# EAGLE design weichen-a-6 (EAGLE 9.6.2)
AUTHOR: Balazs Racz; DRAWING_TITLE: MEB Schalterwerk Projekt; LICENSE: Licensed by the Solderpad Hardware License V2.0; REVIEWER: n/a; REVISION: A5; YEAR: 2023
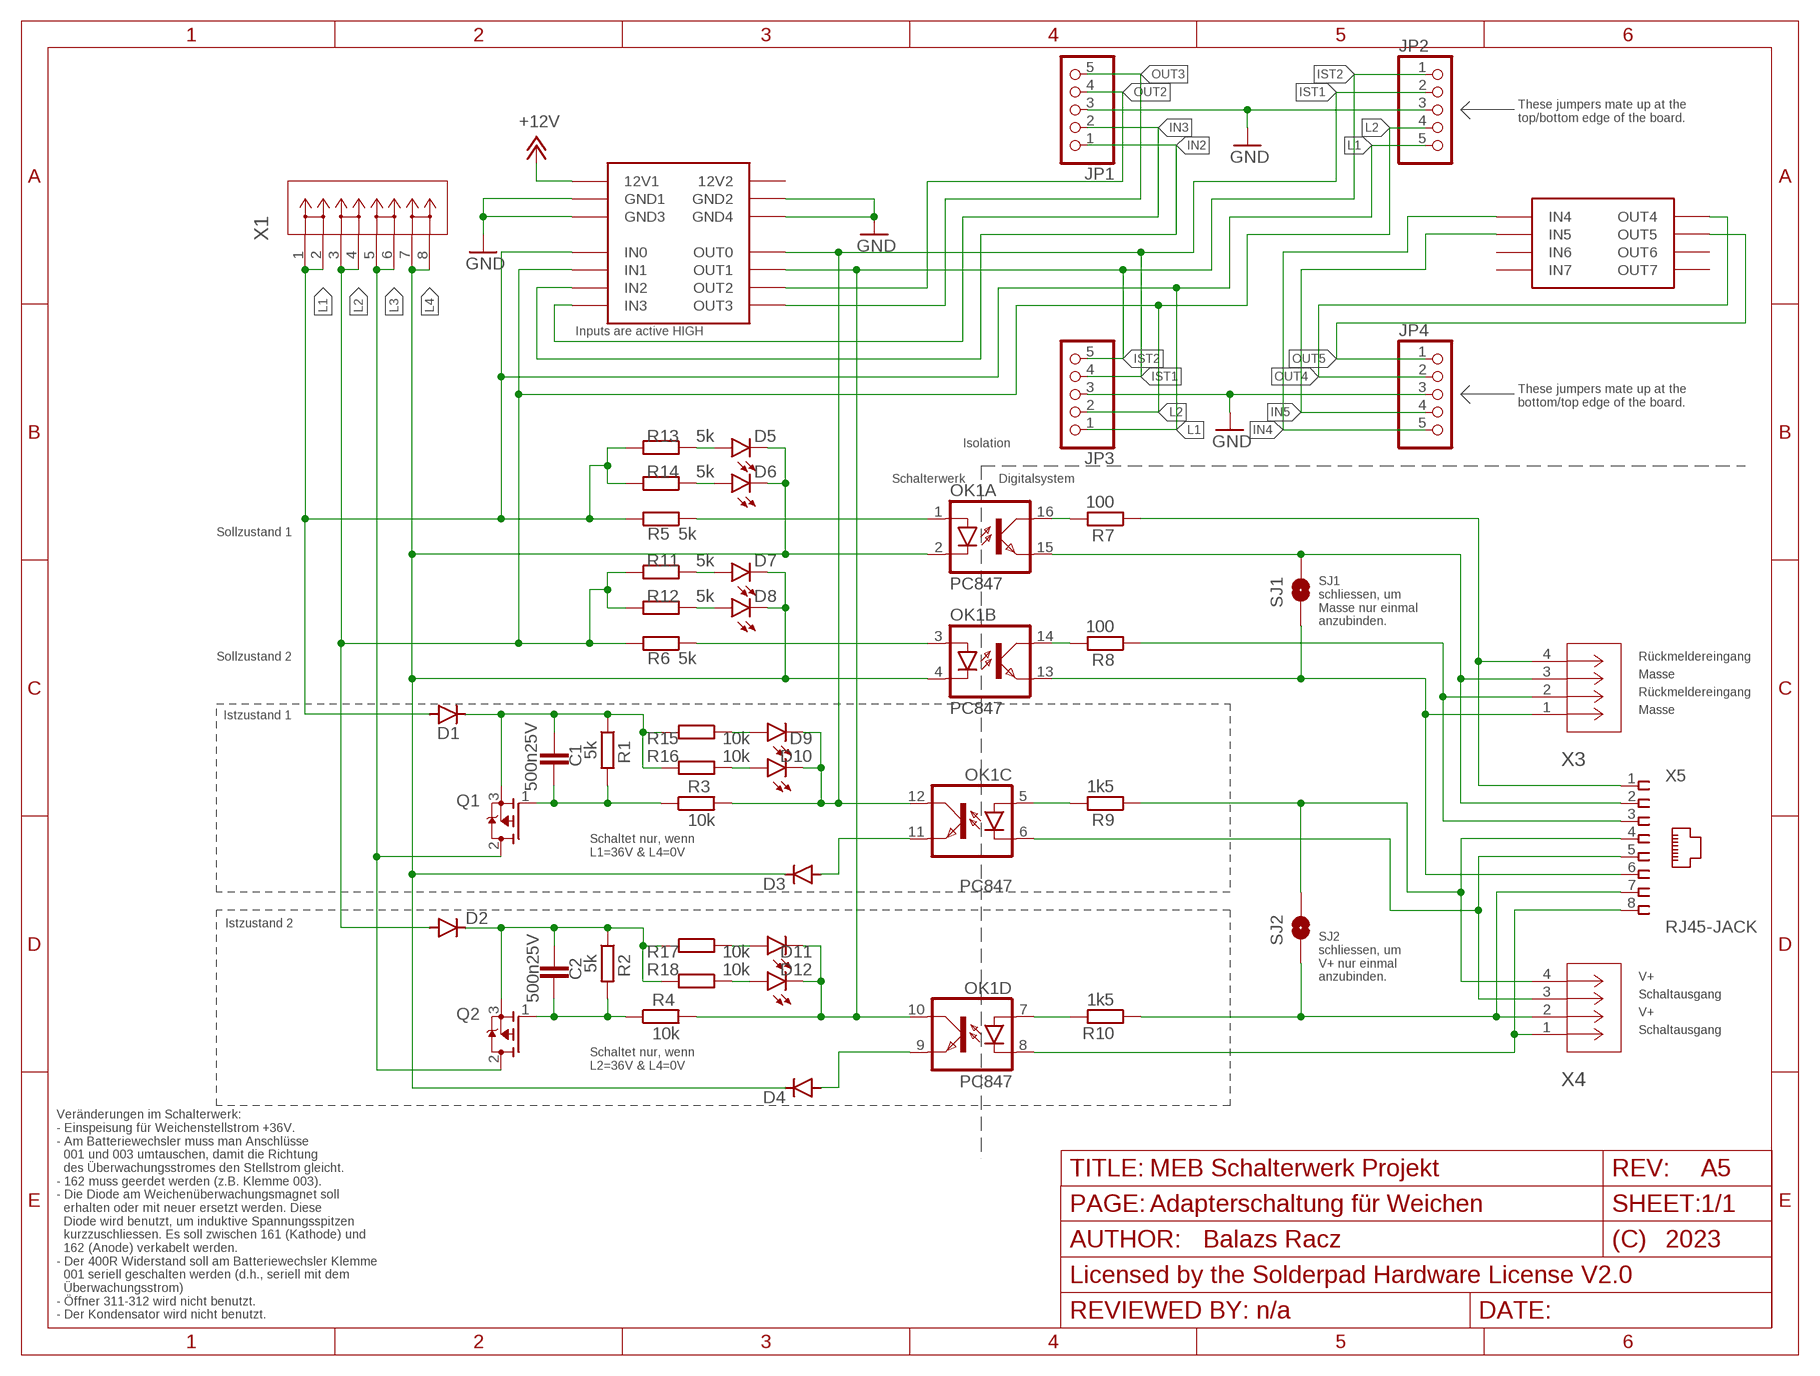
[diagram p0: schematic, sheet 1]
FRAME1 (FRAME_A_L): PAGE: Input ports
FRAME2 (FRAME_A_L): PAGE: Adapterschaltung für Weichen

## Parts
C1  500n25V  C-EUC0805  [C0805]
C2  500n25V  C-EUC0805  [C0805]
D1  DIODE-DO214AC  [DO214AC]
D2  DIODE-DO214AC  [DO214AC]
D3  DIODE-MINIMELF  [MINIMELF]
D4  DIODE-MINIMELF  [MINIMELF]
D5  LEDCHIPLED_0603  [CHIPLED_0603]
D6  LEDHEADER  [LEDHEADER]
D7  LEDCHIPLED_0603  [CHIPLED_0603]
D8  LEDHEADER  [LEDHEADER]
D9  LEDCHIPLED_0603  [CHIPLED_0603]
D10  LEDHEADER  [LEDHEADER]
D11  LEDCHIPLED_0603  [CHIPLED_0603]
D12  LEDHEADER  [LEDHEADER]
JP1  PINHD-1X5-EDGE  [1X05]
JP2  PINHD-1X5-EDGE  [1X05]
JP3  PINHD-1X5-EDGE  [1X05]
JP4  PINHD-1X5-EDGE  [1X05]
OK1  PC847  [DIL16]
Q1  P-MOSFET  [DPAK-2]
Q2  P-MOSFET  [DPAK-2]
R1  5k  R-EU_R0805  [R0805]
R2  5k  R-EU_R0805  [R0805]
R3  10k  R-EU_R0805  [R0805]
R4  10k  R-EU_R0805  [R0805]
R5  5k  R-EU_R0805  [R0805]
R6  5k  R-EU_R0805  [R0805]
R7  100  R-EU_R0805  [R0805]
R8  100  R-EU_R0805  [R0805]
R9  1k5  R-EU_R0805  [R0805]
R10  1k5  R-EU_R0805  [R0805]
R11  5k  R-EU_R0805  [R0805]
R12  5k  R-EU_R0805  [R0805]
R13  5k  R-EU_R0805  [R0805]
R14  5k  R-EU_R0805  [R0805]
R15  10k  R-EU_R0805  [R0805]
R16  10k  R-EU_R0805  [R0805]
R17  10k  R-EU_R0805  [R0805]
R18  10k  R-EU_R0805  [R0805]
SJ1  SJRND2  [SJ_RND2]
SJ2  SJRND2  [SJ_RND2]
X1  PHNX_4P_508CONN_1017493  [PHNX_4P_508]
X2  IO-HAT  [IOBOARD]
X3  PHNX_4P_350CONN_1984989_PXC  [PHNX_4P_350]
X4  PHNX_4P_350CONN_1984989_PXC  [PHNX_4P_350]
X5  RJ45-JACK  RJ45-JACKRJ45-PULSE-E5J00  [RJ45-PULSE-E5J88]

## Nets
+12V: X2.P$1(12V1)
GND: JP1.3 JP2.3 JP3.3 JP4.3 X2.P$2(GND1) X2.P$11(GND3) X2.P$12(GND4) X2.P$21(GND2)
IN2: JP1.1 X2.P$5(IN2)
IN3: JP1.2 X2.P$6(IN3)
IN4: JP4.5 X2.P$7(IN4)
IN5: JP4.4 X2.P$8(IN5)
IST1: D9.C D10.C JP2.2 JP3.4 OK1.12(C:COL) R3.2 X2.P$20(OUT0)
IST2: D11.C D12.C JP2.1 JP3.5 OK1.10(D:COL) R4.2 X2.P$19(OUT1)
L1: D1.A JP2.5 JP3.1 R5.2 R13.2 R14.2 X1.1 X1.2 X2.P$3(IN0)
L2: D2.A JP2.4 JP3.2 R6.2 R11.2 R12.2 X1.3 X1.4 X2.P$4(IN1)
L3: Q1.2(D) Q2.2(D) X1.5 X1.6
L4: D3.C D4.C D5.C D6.C D7.C D8.C OK1.2(A:C) OK1.4(B:C) X1.7 X1.8
N$1: C2.1 D2.C Q2.3(S) R2.1 R17.2 R18.2
N$2: OK1.1(A:A) R5.1
N$3: D7.A R11.1
N$4: D5.A R13.1
N$5: OK1.5(C:A) R9.2
N$6: D6.A R14.1
N$7: OK1.3(B:A) R6.1
N$8: OK1.7(D:A) R10.2
N$10: D8.A R12.1
N$11: D9.A R15.1
N$12: C2.2 Q2.1(G) R2.2 R4.1
N$13: C1.1 D1.C Q1.3(S) R1.1 R15.2 R16.2
N$14: D10.A R16.1
N$17: D3.A OK1.11(C:EMIT)
N$18: D11.A R17.1
N$19: OK1.16(A:COL) R7.2
N$20: D12.A R18.1
N$21: OK1.14(B:COL) R8.2
N$22: D4.A OK1.9(D:EMIT)
N$23: C1.2 Q1.1(G) R1.2 R3.1
NX41: R7.1 X3.4 X5.1
NX42: OK1.15(A:EMIT) SJ1.P$2 X3.3 X5.2
NX43: R8.1 X3.2 X5.3
NX44: R9.1 SJ2.P$2 X4.4 X5.4
NX45: OK1.6(C:C) X4.3 X5.5
NX46: OK1.13(B:EMIT) SJ1.P$1 X3.1 X5.6
NX47: R10.1 SJ2.P$1 X4.2 X5.7
NX48: OK1.8(D:C) X4.1 X5.8
OUT2: JP1.4 X2.P$18(OUT2)
OUT3: JP1.5 X2.P$17(OUT3)
OUT4: JP4.2 X2.P$16(OUT4)
OUT5: JP4.1 X2.P$15(OUT5)
Unconnected: X2.P$9(IN6) X2.P$10(IN7) X2.P$13(OUT7) X2.P$14(OUT6)

## Notes on the sheet
- These jumpers mate up at the 
  top/bottom edge of the board.
- Inputs are active HIGH
- These jumpers mate up at the 
  bottom/top edge of the board.
- Isolation
- Schalterwerk | Digitalsystem
- Sollzustand 1
- SJ1
  schliessen, um
  Masse nur einmal
  anzubinden.
- Sollzustand 2 | Rückmeldereingang
- Masse
- Rückmeldereingang
- Masse
- Istzustand 1
- Schaltet nur, wenn
  L1=36V & L4=0V
- Istzustand 2
- SJ2
  schliessen, um
  V+ nur einmal
  anzubinden.
- V+
- Schaltausgang
- V+
- Schaltausgang
- Schaltet nur, wenn
  L2=36V & L4=0V
- Veränderungen im Schalterwerk:
  - Einspeisung für Weichenstellstrom +36V.
  - Am Batteriewechsler muss man Anschlüsse
    001 und 003 umtauschen, damit die Richtung
    des Überwachungsstromes den Stellstrom gleicht.
  - 162 muss geerdet werden (z.B. Klemme 003).
  - Die Diode am Weichenüberwachungsmagnet soll 
    erhalten oder mit neuer ersetzt werden. Diese
    Diode wird benutzt, um induktive Spannungsspitzen
    kurzzuschliessen. Es soll zwischen 161 (Kathode) und
    162 (Anode) verkabelt werden.
  - Der 400R Widerstand soll am Batteriewechsler Klemme
    001 seriell geschalten werden (d.h., seriell mit dem 
    Überwachungsstrom)
  - Öffner 311-312 wird nicht benutzt.
  - Der Kondensator wird nicht benutzt.

## Power pins joined to a net without a drawn wire
12V2: X2.P$22(12V2)

## Library data of the parts
C1 C2 = rcl:C-EU: CAPACITOR, European symbol; SPICEPREFIX: C
D1-D4 = diode:DIODE-: DIODE
D5 D7 D9 D11 = led:LED: LED OSRAM: - CHIPLED LG R971, LG N971, LY N971, LG Q971, LY Q971, LO R971, LY R971 LH N974, LH R974 LS Q976, LO Q976, LY Q976 LO Q996 - Hyper CHIPLED LW Q18S LB Q993, LB Q99A, LB R99A - SideLED LS A670, LO A670, LY A670, LG A670, LP A670 LB A673, LV A673, LT A673, LW A673 LH A674 LY A675 LS A676, LA A676, LO A676, LY A676, LW A676 LS A679, LY A679, LG A679 - Hyper Micro SIDELED® LS Y876, LA Y876, LO Y876, LY Y876 LT Y87S - SmartLED LW L88C, LW L88S LB L89C, LB L89S, LG L890 LS L89K, LO L89K, LY L89K LS L896, LA L896, LO L896, LY L896 - TOPLED LS T670, LO T670, LY T670, LG T670, LP T670 LSG T670, LSP T670, LSY T670, LOP T670, LYG T670 LG T671, LOG T671, LSG T671 LB T673, LV T673, LT T673, LW T673 LH T674 LS T676, LA T676, LO T676, LY T676, LB T676, LH T676, LSB T676, LW T676 LB T67C, LV T67C, LT T67C, LS T67K, LO T67K, LY T67K, LW E67C LS E67B, LA E67B, LO E67B, LY E67B, LB E67C, LV E67C, LT E67C LW T67C LS T679, LY T679, LG T679 LS T770, LO T770, LY T770, LG T770, LP T770 LB T773, LV T773, LT T773, LW T773 LH T774 LS E675, LA E675, LY E675, LS T675 LS T776, LA T776, LO T776, LY T776, LB T776 LHGB T686 LT T68C, LB T68C - Hyper Mini TOPLED® LB M676 - Mini TOPLED Santana® LG M470 LS M47K, LO M47K, LY M47K Source: http://www.osram.convergy.de LUXEON: - LUMILED® LXK2-PW12-R00, LXK2-PW12-S00, LXK2-PW14-U00, LXK2-PW14-V00 LXK2-PM12-R00, LXK2-PM12-S00, LXK2-PM14-U00 LXK2-PE12-Q00, LXK2-PE12-R00, LXK2-PE12-S00, LXK2-PE14-T00, LXK2-PE14-U00 LXK2-PB12-K00, LXK2-PB12-L00, LXK2-PB12-M00, LXK2-PB14-N00, LXK2-PB14-P00, LXK2-PB14-Q00 LXK2-PR12-L00, LXK2-PR12-M00, LXK2-PR14-Q00, LXK2-PR14-R00 LXK2-PD12-Q00, LXK2-PD12-R00, LXK2-PD12-S00 LXK2-PH12-R00, LXK2-PH12-S00 LXK2-PL12-P00, LXK2-PL12-Q00, LXK2-PL12-R00 Source: www.luxeon.com KINGBRIGHT: KA-3528ASYC Source: www.kingbright.com
D6 D8 D10 D12 = eagleparts:LEDHEADER
JP1-JP4 = eagleparts:PINHD-1X5-EDGE: PIN HEADER
OK1 = optocoupler:PC847: SHARP OPTO COUPLER; OC_FARNELL: 9707735; OC_NEWARK: unknown
Q1 Q2 = eagleparts:P-MOSFET: RoHS Compliant | Low RDS(on) | Industry-leading quality | Dynamic dv/dt Rating | Fast Switching | Fully Avalanche Rated | 175C Operating Temperature | P-Channel MOSFET; MANUFACTURER: Infineon; MAXIMUM_PACKAGE_HEIGHT: 2.39 mm; PARTREV: 12/14/04; STANDARD: IPC-7351B
R1-R18 = rcl:R-EU_: RESISTOR, European symbol; SPICEPREFIX: R
SJ1 SJ2 = eagleparts:SJ: SMD solder JUMPER
X1 = eagleparts:PHNX_4P_508: https://www.digikey.com/en/products/detail/phoenix-contact/1017505/9346606 DigiKey 277-17516-ND; COPYRIGHT: Copyright (C) 2023 Ultra Librarian. All rights reserved.; MANUFACTURER_PART_NUMBER: 1017505; MFR_NAME: Phoenix Contact
X2 = eagleparts:IO-HAT
X3 X4 = eagleparts:PHNX_4P_350: https://www.digikey.com/en/products/detail/phoenix-contact/1984989/2513979 DigiKey 277-6404-ND; COPYRIGHT: Copyright (C) 2023 Ultra Librarian. All rights reserved.; MANUFACTURER_PART_NUMBER: 1984989; MFR_NAME: Phoenix Contact
X5 = trainlib:RJ45-JACK: Mod. Jack, Right Angle, 8 posiotion, 8 contatcs RJ45 Source: GLX-S-88M.pdf

## Board
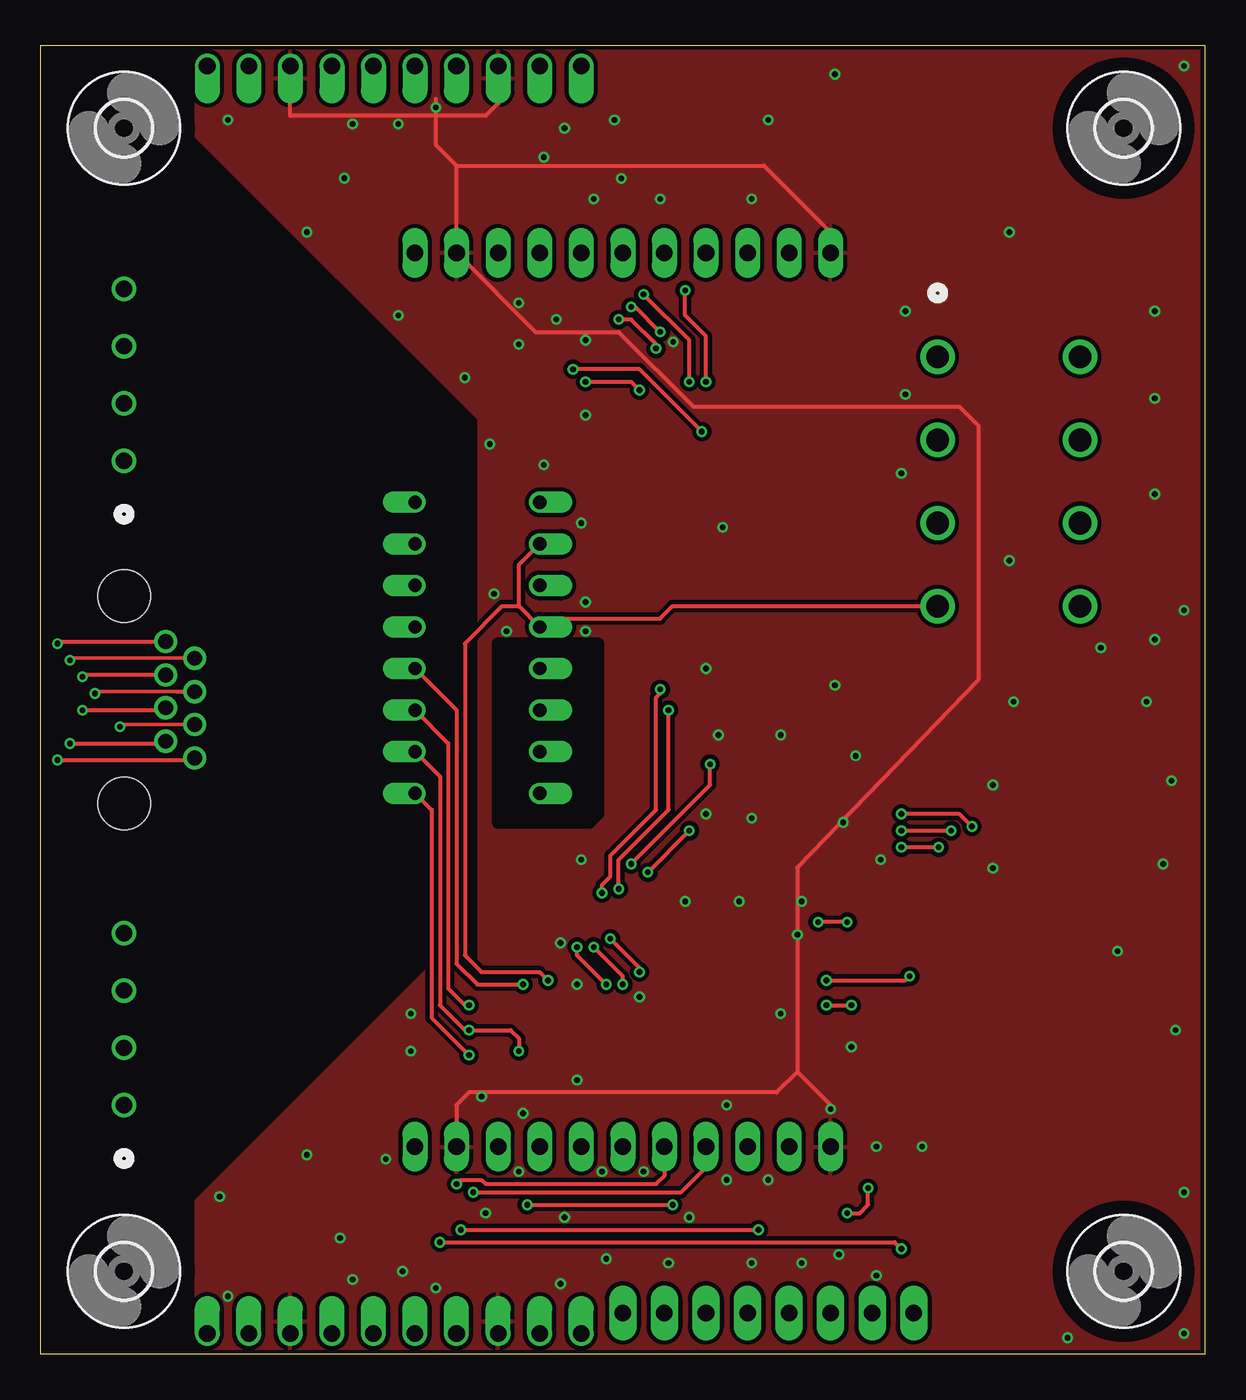
[diagram p1: board, top side]
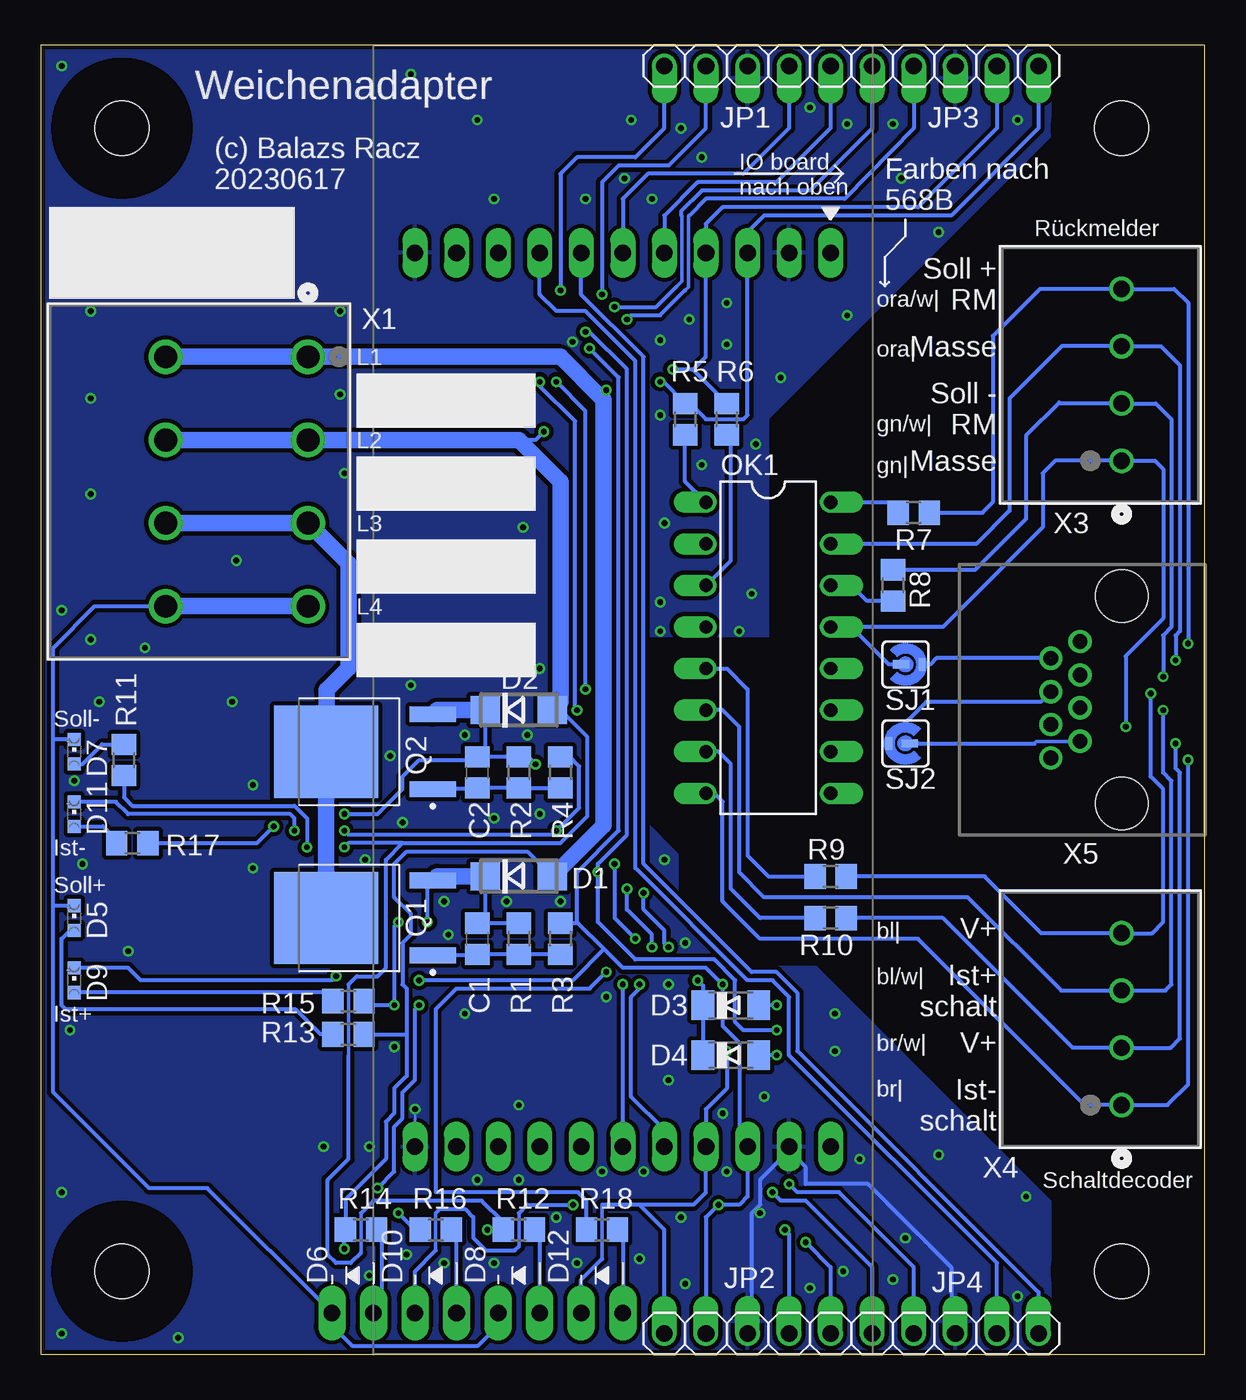
[diagram p2: board, bottom side, seen from below]

Size 71.12 x 80 mm. Coordinates in mm from the lower left corner, seen from the top.
Outline: 71.12,0 0,0 0,80 71.12,80 71.12,0
Copper layers (1*16): Top 0.035mm / dielectric 1.5mm / Bottom 0.035mm
Design rules "SeeedStudio_2layer_DRU_no_angle_20140221": minimum track width 6mil, minimum drill 12mil, track to track 6mil, track to pad 6mil, pad to pad 6mil, via to via 6mil, smd to smd 0mil, copper to edge 10mil, drill to drill 10mil, minimum pad ring 10mil, minimum via ring 6mil, stop-mask expansion 2mil, vias tented up to drill 100mil, thermal gap 10mil
tRestrict: area 27.9,32.5 to 34,43.4
bRestrict: area 19.1,24.1 to 34,43.4

### Footprints (pad centres in the part's own frame; a part is rotated, then mirrored left to right if it is on the bottom)
C0805 = smd 1.3 x 1.5: 1 -0.95,0; 2 0.95,0
DO214AC = smd 1.8 x 1.7: A 2.05,0; C -2.05,0
MINIMELF = smd 1.4 x 1.8: A 1.7,0; C -1.7,0
CHIPLED_0603 = smd 0.8 x 0.8: A 0,-0.75; C 0,0.75
LEDHEADER = drill 1.016 pad 1.676 long: A -1.27,0; C 1.27,0
3,3 = hole 3.3: 0,0
1X05 = drill 1.016 offset: 1 -5.08,0; 2 -2.54,0; 3 0,0; 4 2.54,0; 5 5.08,0
DIL16 = drill 0.813 offset: 1 -8.89,-3.81; 2 -6.35,-3.81; 3 -3.81,-3.81; 4 -1.27,-3.81; 5 1.27,-3.81; 6 3.81,-3.81; 7 6.35,-3.81; 8 8.89,-3.81; 9 8.89,3.81; 10 6.35,3.81; 11 3.81,3.81; 12 1.27,3.81; 13 -1.27,3.81; 14 -3.81,3.81; 15 -6.35,3.81; 16 -8.89,3.81
DPAK-2 = smd 2.83 x 0.97: 1 -4.14,2.29; 3 -4.14,-2.29 | smd 6.35 x 5.63: 2 2.38,0
R0805 = smd 1.3 x 1.5: 1 -0.95,0; 2 0.95,0
SJ_RND2 = smd 1.016 x 0.508: P$1 -0.254,0 | smd 0.406 x 0.813: P$2 1.016,0
PHNX_4P_508 = drill 1.397 pad 1.905: 1 -15.24,8.7; 2 -15.24,0; 3 -10.16,8.7; 4 -10.16,0; 5 -5.08,8.7; 6 -5.08,0; 7 0,8.7; 8 0,0
IOBOARD = drill 1.016 pad 1.524 long: P$1 12.7,27.94; P$2 12.7,25.4; P$3 12.7,22.86; P$4 12.7,20.32; P$5 12.7,17.78; P$6 12.7,15.24; P$7 12.7,12.7; P$8 12.7,10.16; P$9 12.7,7.62; P$10 12.7,5.08; P$11 12.7,2.54; P$12 67.31,2.54; P$13 67.31,5.08; P$14 67.31,7.62; P$15 67.31,10.16; P$16 67.31,12.7; P$17 67.31,15.24; P$18 67.31,17.78; P$19 67.31,20.32; P$20 67.31,22.86; P$21 67.31,25.4; P$22 67.31,27.94
PHNX_4P_350 = drill 0.991 pad 1.499: 1 0,0; 2 3.5,0; 3 7,0; 4 10.5,0
RJ45-PULSE-E5J88 = drill 0.9 pad 1.422: 1 3.555,2.54; 2 2.535,4.32; 3 1.515,2.54; 4 0.495,4.32; 5 -0.495,2.54; 6 -1.515,4.32; 7 -2.535,2.54; 8 -3.555,4.32 | hole 3.2: 6.35,0; -6.35,0

### Placement (x,y rotation side)
C1  44.45,25.4 270 bottom
C2  44.45,35.56 270 bottom
D1  41.91,29.21 0 bottom
D2  41.91,39.37 0 bottom
D3  28.96,21.34 0 bottom
D4  28.96,18.29 0 bottom
D5  69.09,26.67 0 bottom
D6  52.07,2.54 180 bottom
D7  69.09,36.83 0 bottom
D8  41.91,2.54 180 bottom
D9  69.09,22.86 0 bottom
D10  46.99,2.54 180 bottom
D11  69.09,33.02 0 bottom
D12  36.83,2.54 180 bottom
H1  MOUNT-HOLE3.3  [3,3]  66.17,74.93 0 top
H2  MOUNT-HOLE3.3  [3,3]  66.17,5.08 0 top
H3  MOUNT-HOLE3.3  [3,3]  5.08,5.08 0 top
H4  MOUNT-HOLE3.3  [3,3]  5.08,74.93 0 top
JP1  27.94,78.74 180 bottom
JP2  27.94,1.27 0 bottom
JP3  15.24,78.74 180 bottom
JP4  15.24,1.27 0 bottom
OK1  26.67,43.18 270 bottom
Q1  51.31,26.67 180 bottom
Q2  51.31,36.83 180 bottom
R1  41.91,25.4 270 bottom
R2  41.91,35.56 270 bottom
R3  39.37,25.4 90 bottom
R4  39.37,35.56 90 bottom
R5  31.75,57.15 90 bottom
R6  29.21,57.15 90 bottom
R7  17.78,51.44 180 bottom
R8  19.05,46.99 270 bottom
R9  22.86,29.21 180 bottom
R10  22.86,26.67 180 bottom
R11  66.04,36.32 270 bottom
R12  41.91,7.62 180 bottom
R13  52.32,19.56 0 bottom
R14  51.56,7.62 180 bottom
R15  52.32,21.59 0 bottom
R16  46.99,7.62 180 bottom
R17  65.53,31.24 0 bottom
R18  36.83,7.62 180 bottom
SJ1  18.29,42.16 0 bottom
SJ2  18.29,37.34 180 bottom
X1  63.5,45.72 270 bottom
X2  50.8,80.01 270 bottom
X3  5.08,54.61 90 bottom
X4  5.08,15.24 90 bottom
X5  5.08,40.01 90 bottom

### Tracks (layer width: path | path; a pad name or v marks a point on that pad's centre or on a via)
GND  (via drill 0.35)
  Top 0.254: JP1.3 27.94,76.45 27.18,75.69 15.24,75.69 JP3.3 | 24.13,76.71 24.13,73.91 25.4,72.64 | 25.4,72.64 X2.P$2 30.23,62.48 35.31,62.48 39.88,57.91 56.13,57.91 57.28,56.77 57.28,41.2 46.23,29.75 46.23,17.27 | 25.4,72.64 44.2,72.64 48.26,68.58 X2.P$11 | v48.26,14.99 48.26,15.24 46.23,17.27 | 46.23,17.27 44.96,16 26.16,16 25.4,15.24 X2.P$21
  Bottom 0.152: X2.P$12 v48.26,14.99
  Bottom 0.254: X2.P$21 25.4,12.45 | 25.4,12.45 27.18,10.67 27.18,9.14 27.69,8.64 27.69,1.52 JP2.3 | JP4.3 15.49,1.52 15.49,5.33 20.57,10.41 24.38,10.41 24.38,11.43 25.4,12.45
  other vias: 45.21,20.83 36.58,21.84 32.77,16.76 32.77,22.61 22.61,20.83 22.61,18.54 31.75,4.32 10.92,9.65 16.26,12.19 41.91,15.24 51.05,12.7 53.85,12.7 69.34,19.81 69.85,9.91 69.85,1.27 62.74,1.02 43.43,5.59 38.35,5.59 34.54,5.84 46.48,5.59 48.77,6.1 22.1,5.08 18.29,7.11 24.13,4.06 11.43,3.56 21.08,11.94 26.92,15.75 31.75,25.15 33.02,30.23 42.67,27.69 39.37,27.69 46.48,27.69 46.23,25.65 49.78,36.58 45.21,37.85 49.02,32.51 43.43,32.77 40.64,33.02 51.31,30.23 65.79,24.64 68.58,29.97 67.56,39.88 68.07,43.69 64.77,43.18 41.4,37.85 40.64,41.91 48.51,40.89 59.18,48.51 41.66,50.55 52.58,53.85 52.83,58.67 68.07,58.42 68.07,52.58 68.07,63.75 52.83,63.75 59.18,68.58 43.43,70.61 44.45,75.44 35.05,75.44 32,74.93 48.51,78.23 69.85,78.74 24.13,76.2 18.54,71.88 11.43,75.44 21.84,63.5 16.26,68.58 30.73,73.15 25.91,59.69 27.43,55.63 27.69,46.48 28.45,44.2 33.02,50.8 33.27,57.4 33.27,45.97 33.27,44.2 30.73,54.36 29.21,64.26 29.21,61.72 31.5,63.25 33.27,61.98 33.78,70.61 37.85,70.61 29.46,14.73 29.21,11.18 19.05,4.57 69.09,35.05 19.05,75.18 21.84,75.18 35.46,71.86 44.45,10.67 41.91,10.67 49.53,18.8 27.18,8.64 39.62,8.38 32,8.38 34.29,11.18 36.83,11.18 38.63,61.87 51.05,4.83 69.85,45.47 58.17,29.72 58.17,34.8 59.44,39.88
  pour Bottom (isolate 0.254): 70.87,79.76 7.37,79.76 7.37,78.74 9.4,76.71 9.4,74.42 26.67,57.15 26.67,23.88 23.88,23.88 9.4,9.4 9.4,3.3 7.87,1.78 7.87,0.25 70.87,0.25
  pour Top (isolate 0.254): 70.87,79.76 7.37,79.76 7.37,78.74 9.4,76.71 9.4,74.42 26.67,57.15 26.67,23.88 23.88,23.88 9.4,9.4 9.4,3.3 7.87,1.78 7.87,0.25 70.87,0.25
IN2
  Bottom 0.254: JP1.1 22.86,74.93 26.16,71.63 30.99,71.63 33.02,69.6 X2.P$5
IN3
  Bottom 0.254: JP1.2 25.4,74.93 28.19,72.14 34.04,72.14 35.56,70.61 X2.P$6
IN4
  Bottom 0.254: X2.P$7 38.1,64.77 34.29,60.96 34.29,29.97 27.69,23.37 26.16,23.37 24.89,22.1 24.89,18.54 10.16,3.81 JP4.5
IN5
  Bottom 0.254: JP4.4 12.7,5.59 25.4,18.29 25.4,21.84 26.42,22.86 27.94,22.86 34.8,29.72 34.8,60.71 37.85,63.75 39.62,63.75 40.64,64.77 X2.P$8
IST1  (via drill 0.35)  (3 unrouted)
  Top 0.254: OK1.12 25.4,39.37 25.4,23.88 26.67,22.61 v29.46,22.61 | v48.01,22.86 52.83,22.86 v53.09,23.11 | v37.59,61.47 37.59,61.72 36.07,63.25 v35.31,63.25 | v29.72,9.14 v38.61,9.14
  Bottom 0.203: 46.99,6.35 46.99,8.64 | 41.91,6.6 41.91,8.64 | 31.5,69.6 31.55,69.55 31.55,65.23 31.75,65.02
  Bottom 0.254: 38.29,26.35 R3.2 | 36.7,24.77 35.56,23.62 30.48,23.62 v29.46,22.61 29.46,20.07 28.45,19.05 28.45,13.21 X2.P$20 27.94,9.65 28.45,9.14 v29.72,9.14 30.48,8.38 JP2.2 | 36.7,24.77 38.29,26.35 | D10.C 48.26,5.08 46.99,6.35 | 46.99,8.64 46.74,8.89 45.21,8.89 44.7,8.38 44.7,7.11 43.94,6.35 42.16,6.35 41.91,6.6 | 41.91,8.64 41.4,9.14 v38.61,9.14 | 36.7,24.77 38.61,22.86 v48.01,22.86 | v53.09,23.11 53.34,22.86 65.02,22.86 65.79,23.62 69.08,23.62 D9.C | 38.29,26.35 38.35,26.42 38.35,29.46 35.81,32 35.81,59.69 v37.59,61.47 | 31.5,69.6 30.48,70.61 22,70.61 17.78,74.93 JP3.4 | v35.31,63.25 35.05,63.5 33.27,63.5 31.75,65.02
IST2  (via drill 0.35)  (1 unrouted)
  Top 0.254: OK1.10 24.38,35.31 24.38,21.34 25.91,19.81 v26.16,19.81 28.7,19.81 29.21,19.3 v29.21,18.54 | v37.08,29.46 v39.62,32 | v37.85,62.48 36.32,64.01 v36.07,64.01 | v52.58,32 v55.63,32
  Bottom 0.203: 36.83,5.84 36.83,9.14 | 32,69.6 31.95,69.55 31.95,65.58 32.26,65.28
  Bottom 0.254: v26.16,19.81 28.19,19.81 28.7,20.32 28.7,22.86 29.97,24.13 34.8,24.13 37.08,26.42 v37.08,29.46 37.08,29.97 35.31,31.75 35.31,60.2 37.59,62.48 v37.85,62.48 | v29.21,18.54 29.21,16.26 30.48,14.99 X2.P$19 30.48,9.91 31.24,9.14 34.54,9.14 | R4.2 39.3,36.58 38.86,36.58 38.23,35.94 38.23,33.4 v39.62,32 39.88,31.75 52.32,31.75 v52.58,32 | D12.C 38.1,4.57 36.83,5.84 | 34.54,9.14 36.83,9.14 | 32,69.6 32,69.85 30.73,71.12 24.13,71.12 20.32,74.93 JP3.5 | 32.26,65.28 33.53,64.01 v36.07,64.01 | v55.63,32 55.63,32.77 55.88,33.02 65.79,33.02 66.54,33.77 D11.C | 34.54,9.14 33.02,7.62 JP2.1
L1  (via drill 0.35)
  Top 0.254: v24.38,6.86 52.17,6.86 v52.58,6.45 | v33.27,59.44 36.07,59.44 v36.58,58.93
  Bottom 0.254: 36.75,58.34 36.83,58.42 36.83,58.67 v36.58,58.93 | D1.A 41.38,30.73 48.77,30.73 49.53,29.97 49.53,27.94 48.51,26.92 48.51,25.65 49.02,25.15 49.02,22.61 48.77,22.35 48.77,19.56 | 48.77,19.56 48.77,17.02 49.53,16.26 49.53,14.73 50.04,14.22 50.04,11.94 52.51,9.46 R14.2 52.58,7.55 v52.58,6.45 | R13.2 48.77,19.56 | v24.38,6.86 22.86,5.33 JP2.5 | JP3.1 10.16,74.93 15.49,69.6 26.92,69.6 27.94,68.58 X2.P$3 27.94,57.4 28.19,57.15 30.48,57.15 31.43,58.1 R5.2 33.09,59.44 v33.27,59.44
  Bottom 1.016: D1.A 36.75,32.32 36.75,58.34 | 36.83,58.42 39.37,60.96 X1.1 X1.2
L2  (via drill 0.35)
  Top 0.254: v40.39,56.39 36.58,60.2 v32.51,60.2 | v25.65,7.62 v43.84,7.62 | v54.86,30.99 v52.58,30.99
  Bottom 0.203: 51.56,8.64 51.56,6.21 | 52.32,18.22 52.32,22.61
  Bottom 0.254: R6.2 31.27,60.16 | v40.39,56.39 40.89,55.88 X1.3 | 31.27,60.16 30.48,60.96 X2.P$4 30.48,69.09 29.46,70.1 17.53,70.1 12.7,74.93 JP3.2 | 52.32,22.61 51.82,23.11 50.55,23.11 50.04,23.62 50.04,30.23 49.02,31.24 | 49.02,31.24 39.37,31.24 37.72,32.89 37.72,37.72 39.37,39.37 D2.A | 51.56,8.64 50.8,9.39 44.19,9.39 42.86,8.06 R12.2 v43.84,7.62 | v25.65,7.62 25.4,7.37 JP2.4 | v32.51,60.2 31.31,60.2 31.27,60.16 | R11.2 66.04,34.04 65.53,33.53 55.63,33.53 54.86,32.77 v54.86,30.99 | 49.02,31.24 52.32,31.24 v52.58,30.99 | 51.56,6.21 52.19,5.59 53.09,5.59 53.59,6.1 53.59,10.67 52.32,11.94 52.32,18.22
  Bottom 1.016: D2.A 39.37,39.86 39.37,53.34 41.91,55.88 X1.3 X1.4
L3
  Bottom 1.016: Q1.2 Q2.2 53.67,40.59 52.32,41.94 52.32,48.32 X1.5 X1.6
L4  (via drill 0.35)
  Top 0.254: 29.21,45.72 OK1.4 30.99,44.96 37.85,44.96 38.61,45.72 X1.7 | OK1.2 29.21,48.26 29.21,45.72 | 29.21,45.72 28.19,45.72 25.91,43.43 25.91,24.38 26.92,23.37 30.48,23.37 v30.99,22.86
  Bottom 0.254: v30.99,22.86 30.66,22.53 D3.C D4.C | D7.C 70.36,37.58 | D5.C 70.36,27.42 | 70.36,27.42 70.36,16 64.52,10.16 60.96,10.16 D6.C 53.34,1.78 52.07,0.51 44.45,0.51 43.18,1.78 D8.C | 70.36,27.42 70.36,37.58 | 70.36,37.58 70.36,43.18 67.82,45.72 X1.8
  Bottom 1.016: X1.7 X1.8
N$1  (via drill 0.35)
  Top 0.254: v36.58,23.37 36.58,23.62 v34.8,25.4 | v36.07,29.97 40.89,34.8 v40.89,36.07 | v56.9,32.26 56.13,33.02 v52.58,33.02
  Bottom 0.254: D2.C 43.94,39.35 43.94,37.02 C2.1 | C2.1 R2.1 41.34,36.51 v40.89,36.07 | R18.2 37.78,9.4 38.29,9.91 46.99,9.91 46.99,21.08 45.72,22.35 37.59,22.35 v36.58,23.37 | v34.8,25.4 36.07,26.67 v36.07,29.97 | R17.2 57.91,31.24 v56.9,32.26 | v52.58,33.02 50.55,33.02 49.02,34.54 49.02,35.31 48.01,36.32 44.64,36.32 C2.1
  Bottom 1.016: Q2.3 46.92,39.37 D2.C
N$2
  Bottom 0.254: OK1.1 31.75,53.34 R5.1
N$3
  Bottom 0.254: D7.A 68.57,36.08 67.38,37.27 R11.1
N$4
  Bottom 0.254: R13.1 54.04,19.56 55.56,21.08 69.6,21.08 69.85,21.34 69.85,25.4 69.33,25.92 D5.A
N$5
  Bottom 0.254: OK1.5 29.21,41.91 27.94,40.64 27.94,30.48 26.67,29.21 R9.2
N$6
  Bottom 0.254: D6.A 50.29,3.05 50.29,7.62 R14.1
N$7
  Bottom 0.254: OK1.3 28.96,48.51 28.96,55.95 R6.1
N$8
  Bottom 0.254: R10.2 27.18,26.67 28.96,28.45 28.96,36.07 29.72,36.83 OK1.7
N$10
  Bottom 0.254: R12.1 40.64,7.3 D8.A
N$11
  Bottom 0.254: R15.1 53.79,22.11 D9.A
N$12
  Bottom 0.254: R4.1 R2.2 C2.2 44.52,34.54 Q2.1
N$13  (via drill 0.35)
  Top 0.254: v49.28,26.42 v47.5,26.42 | v49.28,8.64 50.04,8.64 50.55,9.14 v50.55,10.16 | v48.01,21.34 v49.53,21.34
  Bottom 0.254: R1.1 C1.1 43.96,26.84 D1.C | R15.2 51.37,21.34 v49.53,21.34 49.53,26.16 v49.28,26.42 | v47.5,26.42 47.5,28.63 Q1.3 | R16.2 48.26,7.62 v49.28,8.64 | v50.55,10.16 49.53,11.18 49.53,13.92 49.02,14.43 49.02,16 48.26,16.76 48.26,21.08 v48.01,21.34
  Bottom 1.016: Q1.3 46.92,29.21 D1.C
N$14
  Bottom 0.254: D10.A 45.72,7.3 R16.1
N$17  (via drill 0.35)
  Top 0.254: OK1.11 24.89,37.34 24.89,22.35 25.91,21.34 v26.16,21.34
  Bottom 0.254: v26.16,21.34 D3.A
N$18
  Bottom 0.254: D11.A 67.32,32.27 66.48,31.43 R17.1
N$19
  Bottom 0.254: OK1.16 19.36,52.07 R7.2
N$20
  Bottom 0.254: R18.1 35.56,7.3 D12.A
N$21
  Bottom 0.254: R8.2 20.64,46.04 21.59,46.99 OK1.14
N$22  (via drill 0.35)
  Top 0.254: OK1.9 23.88,33.27 23.88,20.57 v26.16,18.29
  Bottom 0.254: v26.16,18.29 D4.A
N$23
  Bottom 0.254: R3.1 R1.2 C1.2 44.52,24.38 Q1.1
NX41  (via drill 0.35)  (2 unrouted)
  Top 0.254: v1.02,43.43 1.14,43.56 X5.1
  Bottom 0.254: v1.02,43.43 1.02,64.26 1.86,65.11 X3.4 10.07,65.11 12.95,62.23 12.95,52.07 13.59,51.44 R7.1
NX42  (via drill 0.35)  (1 unrouted)
  Top 0.203: X5.2 1.9,42.54
  Top 0.254: 1.9,42.54 v1.78,42.42
  Bottom 0.254: v1.78,42.42 1.78,43.94 1.52,44.2 1.52,60.45 2.68,61.61 X3.3 8.75,61.61 11.94,58.42 11.94,51.56 13.97,49.53 OK1.15 | X5.2 16.39,42.54 16.76,42.16 SJ1.P$2
NX43  (via drill 0.35)
  Top 0.254: X5.3 2.66,41.52 v2.54,41.4
  Bottom 0.254: v2.54,41.4 2.54,43.94 2.03,44.45 2.03,57.15 2.99,58.11 X3.2 8.83,58.11 8.89,58.17 10.92,56.13 10.92,51.05 14.04,47.94 R8.1
NX44  (via drill 0.35)
  Top 0.203: 3.42,40.5 8.28,40.5
  Top 0.254: 3.42,40.5 v3.3,40.39 | 8.28,40.5 X5.4
  Bottom 0.254: v3.3,40.39 3.3,35.31 2.54,34.54 2.54,26.42 3.22,25.74 X4.4 9.99,25.74 13.46,29.21 R9.1 | X5.4 10.02,39.88 17.02,39.88 19.05,37.85 19.05,37.59 SJ2.P$2
NX45  (via drill 0.35)
  Top 0.254: v2.54,39.37 7.48,39.37 X5.5
  Bottom 0.254: v2.54,39.37 2.54,35.56 2.03,35.05 2.03,22.61 2.4,22.24 X4.3 8.78,22.24 14.48,27.94 26.92,27.94 28.45,29.46 28.45,38.35 29.46,39.37 OK1.6
NX46  (via drill 0.35)
  Top 0.203: X5.6 4.96,38.49
  Top 0.254: 4.96,38.49 v4.83,38.35
  Bottom 0.254: v4.83,38.35 4.83,42.67 2.54,44.96 2.54,54.1 3.05,54.61 X3.1 9.14,54.61 9.91,53.85 9.91,50.55 16,44.45 OK1.13 21.59,44.45 19.3,42.16 SJ1.P$1
NX47  (via drill 0.35)
  Top 0.254: v1.78,37.34 7.49,37.34 X5.7
  Bottom 0.203: X5.7 10.29,37.47 10.41,37.33
  Bottom 0.254: v1.78,37.34 1.78,35.81 1.52,35.56 1.52,19.3 2.09,18.74 X4.2 8.07,18.74 16,26.67 R10.1 | SJ2.P$1 17.53,37.34 10.41,37.33
NX48  (via drill 0.35)  (2 unrouted)
  Top 0.254: v1.02,36.32 9.27,36.32 X5.8
  Bottom 0.254: v1.02,36.32 1.02,16.51 2.29,15.24 X4.1 7.37,15.24 17.53,25.4 27.18,25.4 29.46,27.69 29.46,33.78 29.97,34.29 OK1.8
OUT2  (via drill 0.35)
  Top 0.254: v34.54,22.61 32.77,24.38 v32.77,24.89 | v34.29,28.19 34.29,28.7 34.8,29.21 34.8,30.48 37.59,33.27 37.59,40.13 37.85,40.39 v37.85,40.64 | v39.62,59.44 39.62,61.98 v36.83,64.77
  Bottom 0.254: X2.P$18 33.02,13.72 35.05,15.75 35.05,21.84 34.54,22.35 v34.54,22.61 | v32.77,24.89 33.02,25.15 33.02,25.91 34.29,27.18 v34.29,28.19 | v39.62,59.44 37.85,57.66 v37.85,40.64 | v36.83,64.77 36.83,71.63 35.81,72.64 32.77,72.64 30.48,74.93 JP1.4
OUT3  (via drill 0.35)
  Top 0.254: v35.56,22.61 35.56,23.11 v33.78,24.89 | v35.31,28.45 35.31,30.23 38.35,33.27 v38.35,39.37 | v40.64,59.44 40.64,62.23 39.37,63.5 v39.37,65.02
  Bottom 0.254: X2.P$17 v35.56,22.61 | v33.78,24.89 33.78,25.65 35.31,27.18 v35.31,28.45 | v38.35,39.37 38.48,39.5 38.48,57.02 40.64,59.18 v40.64,59.44 | v39.37,65.02 39.37,72.14 38.35,73.15 34.8,73.15 33.02,74.93 JP1.5
OUT4  (via drill 0.35)
  Top 0.254: v25.4,10.41 25.65,10.67 26.92,10.67 27.18,10.41 37.59,10.41 38.1,10.92 X2.P$16
  Bottom 0.254: JP4.2 17.78,5.33 22.35,9.91 24.89,9.91 v25.4,10.41
OUT5  (via drill 0.35)
  Top 0.254: v26.42,9.91 39.12,9.91 40.64,11.43 X2.P$15
  Bottom 0.254: JP4.1 20.32,5.33 24.38,9.4 25.91,9.4 v26.42,9.91

### Text on the board
bNames: Weichenadapter | Farben nach / 568B | IO board / nach oben | (c) Balazs Racz / 20230617 | Rückmelder | Soll + / RM | ora/w| | Masse | ora| | L1 | Soll - / RM | gn/w| | L2 | Masse | gn| | L3 | L4 | Soll- | Ist- | Soll+ | V+ | bl| | bl/w| | Ist+ / schalt | Ist+ | V+ | br/w| | br| | Ist- / schalt | Schaltdecoder